# Altium schematic sheet Sch_Salah_Controller.SchDoc
size A2; SheetNumber: 3; SheetTotal: 3
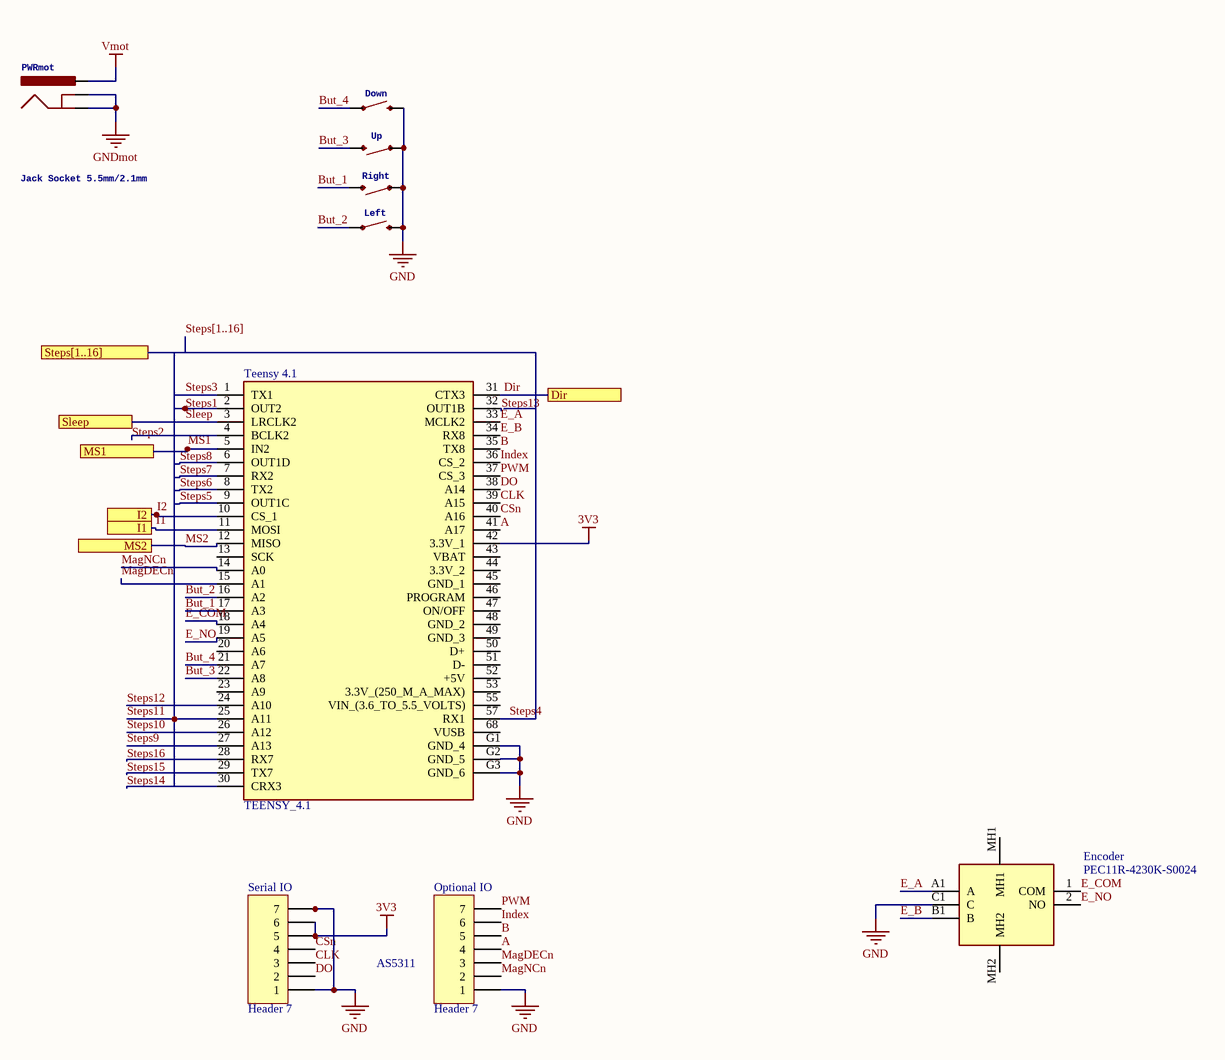
[diagram p0: Sch_Salah_Controller.SchDoc]

## Parts
Down  (no value)  [TACTILE_SWITCH_PTH_6.0MM]
Encoder  PEC11R-4230K-S0024  [PEC11R4230KS0024]
Left  (no value)  [TACTILE_SWITCH_PTH_6.0MM]
Optional_IO  Header 7  [HDR1X7]
PWRmot  Jack Socket 5.5mm/2.1mm  [POWER_JACK_PTH_LOCK]
Right  (no value)  [TACTILE_SWITCH_PTH_6.0MM]
Serial_IO  Header 7  [HDR1X7]
Teensy_4.1  TEENSY_4.1  [TEENSY41]
Up  (no value)  [TACTILE_SWITCH_PTH_6.0MM]

## Ports
Dir, I1, I2, MS1, MS2, Sleep, Steps[1..16]

## Nets
3V3: Serial_IO.5 Serial_IO.6 Teensy_4.1.42(3.3V_1)
GND: Down.3 Encoder.C1(C) Left.3 Optional_IO.1 Right.1 Serial_IO.1 Serial_IO.7 Teensy_4.1.G1(GND_4) Teensy_4.1.G2(GND_5) Teensy_4.1.G3(GND_6) Up.1
GNDmot: PWRmot.GND PWRmot.GNDBREAK
Vmot: PWRmot.PWR
A: Optional_IO.4 Teensy_4.1.41(A17)
B: Optional_IO.5 Teensy_4.1.35(TX8)
But_1: Right.3 Teensy_4.1.17(A3)
But_2: Left.1 Teensy_4.1.16(A2)
But_3: Teensy_4.1.22(A8) Up.3
But_4: Down.1 Teensy_4.1.21(A7)
CLK: Serial_IO.3 Teensy_4.1.39(A15)
CSn: Serial_IO.4 Teensy_4.1.40(A16)
Dir: Teensy_4.1.31(CTX3) ; port Dir
DO: Serial_IO.2 Teensy_4.1.38(A14)
E_A: Encoder.A1(A) Teensy_4.1.33(MCLK2)
E_B: Encoder.B1(B) Teensy_4.1.34(RX8)
E_COM: Encoder.1(COM) Teensy_4.1.18(A4)
E_NO: Encoder.2(NO) Teensy_4.1.19(A5)
I1: Teensy_4.1.11(MOSI) ; port I1
I2: Teensy_4.1.10(CS_1) ; port I2
Index: Optional_IO.6 Teensy_4.1.36(CS_2)
MagDECn: Optional_IO.3 Teensy_4.1.15(A1)
MagNCn: Optional_IO.2 Teensy_4.1.14(A0)
MS1: Teensy_4.1.5(IN2) ; port MS1
MS2: Teensy_4.1.12(MISO) ; port MS2
PWM: Optional_IO.7 Teensy_4.1.37(CS_3)
Sleep: Teensy_4.1.3(LRCLK2) ; port Sleep
Steps1: Teensy_4.1.2(OUT2)
Steps2: Teensy_4.1.4(BCLK2)
Steps3: Teensy_4.1.1(TX1)
Steps4: Teensy_4.1.57(RX1)
Steps5: Teensy_4.1.9(OUT1C)
Steps6: Teensy_4.1.8(TX2)
Steps7: Teensy_4.1.7(RX2)
Steps8: Teensy_4.1.6(OUT1D)
Steps9: Teensy_4.1.27(A13)
Steps10: Teensy_4.1.26(A12)
Steps11: Teensy_4.1.25(A11)
Steps12: Teensy_4.1.24(A10)
Steps13: Teensy_4.1.32(OUT1B)
Steps14: Teensy_4.1.30(CRX3)
Steps15: Teensy_4.1.29(TX7)
Steps16: Teensy_4.1.28(RX7)

Not connected (* = marked no-connect by the designer): Encoder MH1 MH2; Teensy_4.1 13(SCK) 20(A6) 23(A9) 43(VBAT) 44(3.3V_2) 45(GND_1) 46(PROGRAM) 47(ON/OFF) 48(GND_2) 49(GND_3) 50(D+) 51(D-) 52(+5V) 53(3.3V_(250_M_A_MAX)) 55(VIN_(3.6_TO_5.5_VOLTS)) 68(VUSB)

## Buses and harness runs
bus Steps[1..16] = port Steps[1..16]

## Notes on the sheet
- AS5311

## Library data of the parts
Down Left Right Up = MOMENTARY-SWITCH-SPST-PTH-6.0MM: PROD_ID: SWCH-08441; SF_SKU: COM-00097
Encoder = PEC11R-4230K-S0024: Integrated Circuit; Manufacturer_Name: Bourns; Datasheet Link: https://www.mouser.co.uk/datasheet/2/54/PEC11R-777457.pdf; Height: 36.5mm; Manufacturer_Part_Number: PEC11R-4230K-S0024; Mouser Part Number: 652-PEC11R4230KS0024; Mouser Price/Stock: https://www.mouser.co.uk/ProductDetail/Bourns/PEC11R-4230K-S0024?qs=5aG0NVq1C4wTaYIm44OGuA%3D%3D
Optional_IO Serial_IO = Header 7: Header, 7-Pin; LatestRevisionDate: 17-Jul-2002; LatestRevisionNote: Re-released for DXP Platform.; Publisher: Altium Limited
PWRmot = POWER_JACKPTH_LOCK: PROD_ID: CONN-08197; SF_ID: PRT-00119
Teensy_4.1 = TEENSY_4.1: Integrated Circuit; Manufacturer_Name: PJRC; Manufacturer_Part_Number: TEENSY 4.1; Datasheet Link: https://www.pjrc.com/store/teensy41.html; Height: 4.07mm